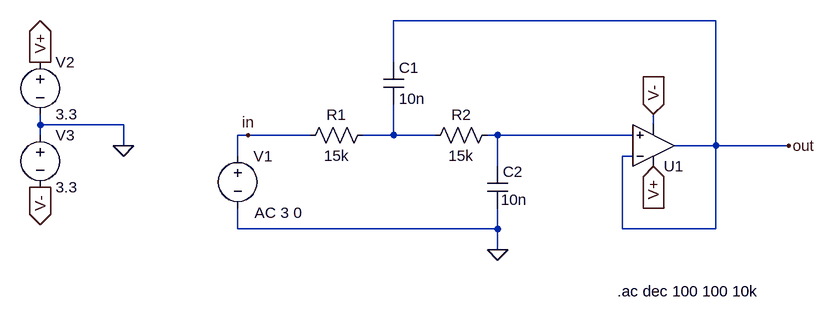
[diagram p0: schematic Tiefpass_2_Ordnung.asc]
Tiefpass_2_Ordnung.asc, the LTspice schematic file:
Version 4
SHEET 1 1204 680
WIRE 672 -80 176 -80
WIRE 176 -16 176 -80
WIRE -368 80 -368 64
WIRE -240 80 -368 80
WIRE 576 80 576 64
WIRE -368 96 -368 80
WIRE -48 96 -64 96
WIRE 48 96 -48 96
WIRE 176 96 176 48
WIRE 176 96 128 96
WIRE 240 96 176 96
WIRE 336 96 320 96
WIRE 544 96 336 96
WIRE -240 112 -240 80
WIRE 672 112 672 -80
WIRE 672 112 608 112
WIRE 784 112 672 112
WIRE -64 128 -64 96
WIRE 544 128 528 128
WIRE 336 144 336 96
WIRE 576 144 576 128
WIRE -64 240 -64 208
WIRE 336 240 336 208
WIRE 336 240 -64 240
WIRE 528 240 528 128
WIRE 672 240 672 112
WIRE 672 240 528 240
WIRE 336 272 336 240
FLAG -240 112 0
FLAG -368 -16 V+
IOPIN -368 -16 Out
FLAG 576 144 V+
IOPIN 576 144 In
FLAG 576 64 V-
IOPIN 576 64 In
FLAG -368 176 V-
IOPIN -368 176 Out
FLAG 336 272 0
FLAG -48 96 in
FLAG 784 112 out
SYMBOL OpAmps\\UniversalOpamp2 576 112 M180
SYMATTR InstName U1
SYMATTR Value2 Avol=400k GBW=1Meg Slew=600k
SYMATTR SpiceLine Ilimit=20m Rail=25m Vos=0 phimargin=90
SYMATTR SpiceLine2 En=0 Enk=0 In=0 Ink=0 Rin=10T
SYMBOL voltage -64 112 R0
WINDOW 123 26 103 Left 2
WINDOW 39 0 0 Left 0
WINDOW 3 24 152 Left 2
SYMATTR Value2 AC 3 0
SYMATTR Value ""
SYMATTR InstName V1
SYMBOL voltage -368 -32 R0
SYMATTR InstName V2
SYMATTR Value 3.3
SYMBOL voltage -368 80 R0
SYMATTR InstName V3
SYMATTR Value 3.3
SYMBOL cap 160 -16 R0
SYMATTR InstName C1
SYMATTR Value 10n
SYMBOL cap 320 144 R0
WINDOW 3 21 51 Left 2
SYMATTR Value 10n
SYMATTR InstName C2
SYMBOL res 224 112 R270
WINDOW 0 32 56 VTop 2
WINDOW 3 0 56 VBottom 2
SYMATTR InstName R2
SYMATTR Value 15k
SYMBOL res 144 80 R90
WINDOW 0 0 56 VBottom 2
WINDOW 3 32 56 VTop 2
SYMATTR InstName R1
SYMATTR Value 15k
TEXT 520 336 Left 2 !.ac dec 100 100 10k

The netlist it stands for:
* Tiefpass_2_Ordnung.asc
XU1 N002 out V+ V- out level.2 Avol=400k GBW=1Meg Slew=600k Ilimit=20m Rail=25m Vos=0 phimargin=90 En=0 Enk=0 In=0 Ink=0 Rin=10T  ; pins IN+ IN- V+ V- OUT
V1 in 0 AC 3 0
V2 V+ 0 3.3
V3 0 V- 3.3
C1 out N001 10n
C2 N002 0 10n
R2 N001 N002 15k
R1 N001 in 15k
.ac dec 100 100 10k
.lib UniversalOpamps2.sub
.backanno
.end